# Altium schematic sheet [06] - Master_PLCModule.SchDoc: =ProjectName
size A4; CheckedBy: Ven; Author: Ven; CompanyName: HUST; Revision: V.1.0
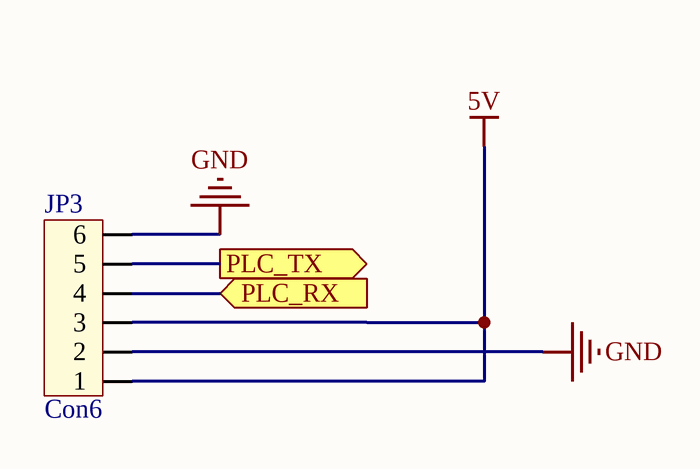
[diagram p0: [06] - Master_PLCModule.SchDoc]

## Parts
JP3  Con6  [CON6]

## Ports
PLC_RX (in), PLC_TX (out)

## Nets
5V: JP3.1 JP3.3
GND: JP3.2 JP3.6
PLC_RX: JP3.4 ; port PLC_RX
PLC_TX: JP3.5 ; port PLC_TX

## Notes on the sheet
- Project:
- Page Contents:
- Size:
- Date:
- A4
- Checked by:
- Time:
- Revision:
- Sheet
- of
- File:

## Library data of the parts
JP3 = Con6: PLC module; Value: Connector 6